# Altium schematic sheet VESC6.0.SchDoc
size A3
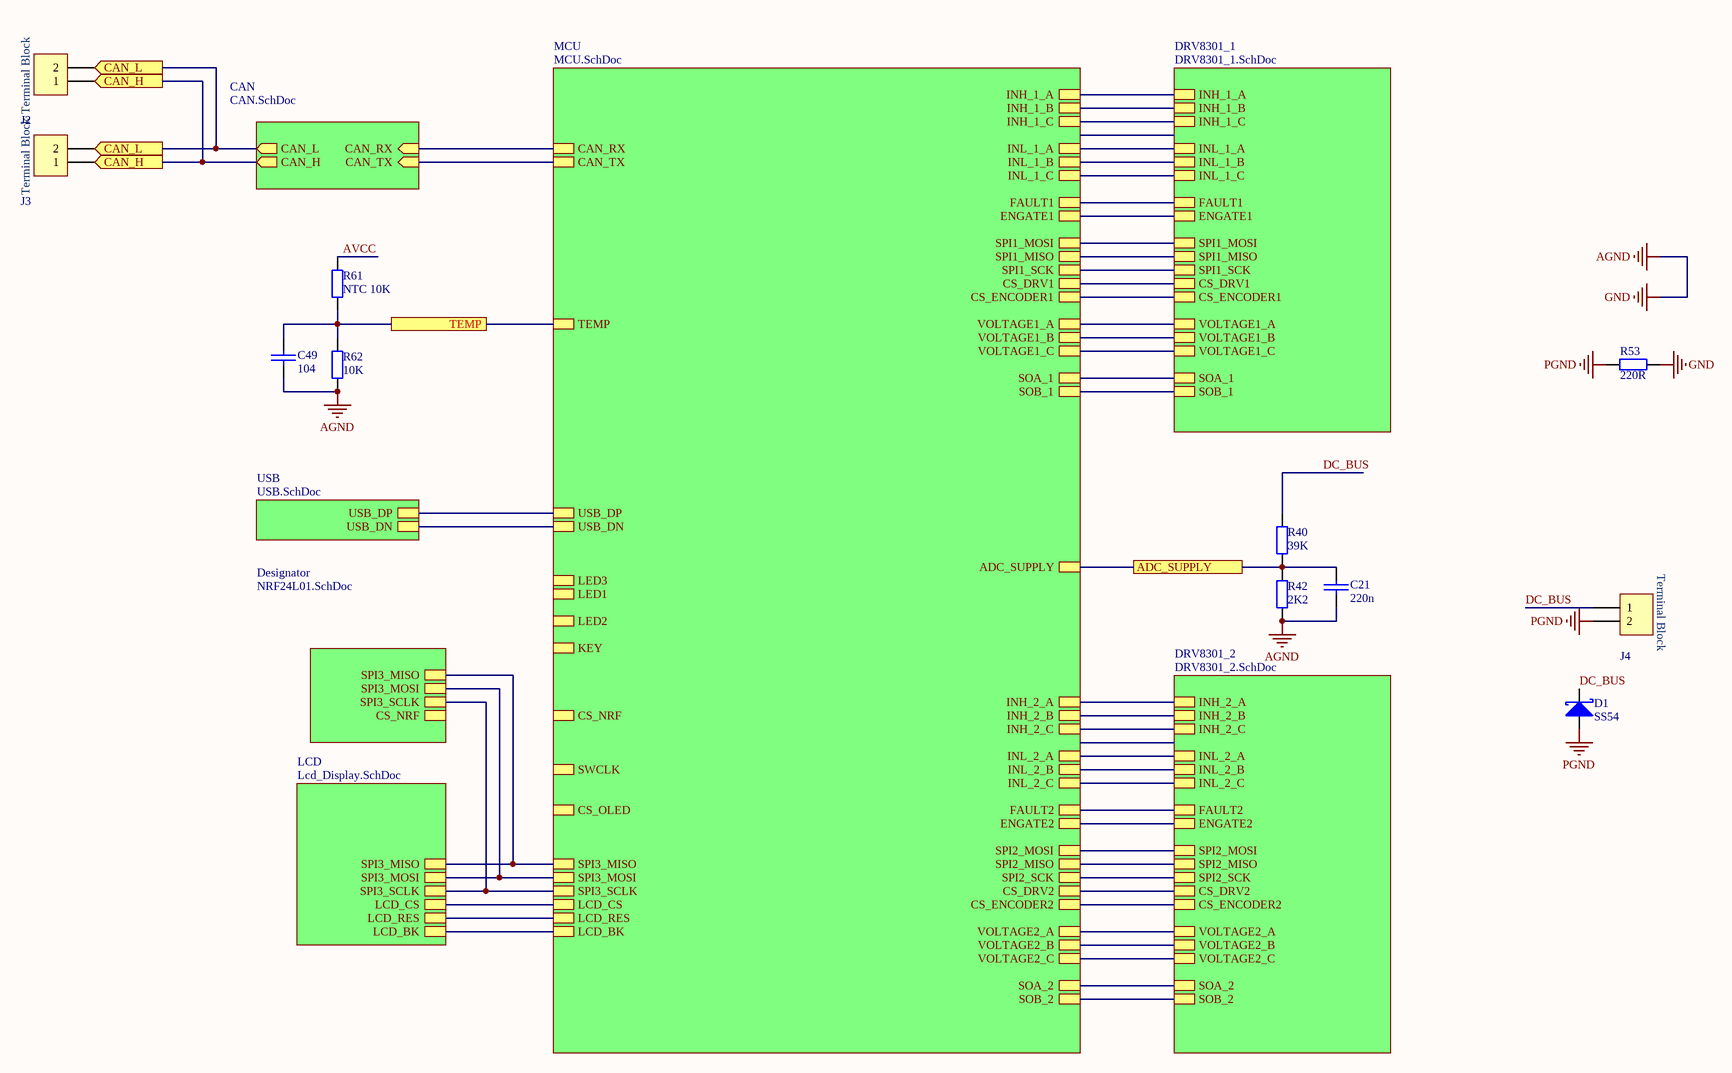
[diagram p0: VESC6.0.SchDoc]

## Parts
C21  value 220n  [0402C]  (hidden comment: CAP)
C49  value 104  [0402C]  (hidden comment: CAP)
D1  SS54  [DIODE_3*5.3]
J2  Terminal Block 2P  [A1002WR-S-2P]  (value not drawn)
J3  Terminal Block 2P  [A1002WR-S-2P]  (value not drawn)
J4  Terminal Block 2P  [POWER]  (value not drawn)
R40  39K  [0402R]
R42  2K2  [0402R]
R53  220R  [1206_R]
R61  NTC 10K  [0402R]
R62  10K  [0402R]

## Sub-sheets
CAN = CAN.SchDoc: CAN_H (out), CAN_RX (in), CAN_TX (in), CAN_L (out)
Designator = NRF24L01.SchDoc: SPI3_MISO, SPI3_SCLK, SPI3_MOSI, CS_NRF
DRV8301_1 = DRV8301_1.SchDoc: INL_1_B, INL_1_C, INH_1_B, INH_1_C, INH_1_A, INL_1_A, SPI1_MISO, SPI1_SCK, SPI1_MOSI, FAULT1, CS_DRV1, ENGATE1, VOLTAGE1_B, VOLTAGE1_A, VOLTAGE1_C, CS_ENCODER1, SOB_1, SOA_1
DRV8301_2 = DRV8301_2.SchDoc: INL_2_A, INH_2_C, INL_2_C, INH_2_B, INL_2_B, INH_2_A, SPI2_SCK, CS_DRV2, FAULT2, ENGATE2, SPI2_MOSI, SPI2_MISO, VOLTAGE2_C, VOLTAGE2_A, VOLTAGE2_B, CS_ENCODER2, SOB_2, SOA_2
LCD = Lcd_Display.SchDoc: SPI3_MISO, LCD_CS, SPI3_MOSI, LCD_RES, SPI3_SCLK, LCD_BK
MCU = MCU.SchDoc: INH_2_B, INH_2_A, INL_2_B, INL_2_A, INL_2_C, INH_2_C, INH_1_C, INH_1_A, INL_1_C, INH_1_B, INL_1_B, INL_1_A, VOLTAGE1_B, ADC_SUPPLY, USB_DP, VOLTAGE1_A, VOLTAGE2_B, VOLTAGE2_A, VOLTAGE1_C, USB_DN, CAN_RX, CAN_TX, VOLTAGE2_C, SPI3_MISO, CS_NRF, SPI3_MOSI, ENGATE2, CS_ENCODER1, SWCLK, SPI3_SCLK, FAULT2, CS_DRV2, CS_DRV1, CS_OLED, CS_ENCODER2, ENGATE1, FAULT1, LED1, SPI2_MISO, LED3, SPI1_MOSI, SPI2_SCK, KEY, LED2, SPI2_MOSI, SPI1_SCK, SPI1_MISO, LCD_CS, LCD_RES, LCD_BK, SOA_2, SOB_2, SOB_1, SOA_1, TEMP
USB = USB.SchDoc: USB_DP, USB_DN

## Ports
ADC_SUPPLY, CAN_H (out), CAN_L (out), TEMP

## Nets
AGND: C21.2 C49.2 R42.2 R53.2 R62.2  [also labelled GND]
PGND: D1.1(A) J4.2 R53.1
ADC_SUPPLY: C21.1 R40.1 R42.1 ; port ADC_SUPPLY, sheet MCU/ADC_SUPPLY
AVCC: R61.2
CAN_H: J2.1 J3.1 ; port CAN_H, sheet CAN/CAN_H
CAN_L: J2.2 J3.2 ; port CAN_L, sheet CAN/CAN_L
DC_BUS: D1.2(K) J4.1 R40.2
TEMP: C49.1 R61.1 R62.1 ; port TEMP, sheet MCU/TEMP
(unnamed): sheet DRV8301_1/INL_1_B, sheet MCU/INL_1_B
(unnamed): sheet DRV8301_1/INL_1_C, sheet MCU/INL_1_C
(unnamed): sheet DRV8301_1/INH_1_B, sheet MCU/INH_1_B
(unnamed): sheet DRV8301_1/INH_1_C, sheet MCU/INH_1_C
(unnamed): sheet DRV8301_1/INH_1_A, sheet MCU/INH_1_A
(unnamed): sheet DRV8301_1/INL_1_A, sheet MCU/INL_1_A
(unnamed): sheet DRV8301_1/SPI1_MISO, sheet MCU/SPI1_MISO
(unnamed): sheet DRV8301_1/SPI1_SCK, sheet MCU/SPI1_SCK
(unnamed): sheet DRV8301_1/SPI1_MOSI, sheet MCU/SPI1_MOSI
(unnamed): sheet DRV8301_1/FAULT1, sheet MCU/FAULT1
(unnamed): sheet DRV8301_1/CS_DRV1, sheet MCU/CS_DRV1
(unnamed): sheet DRV8301_1/ENGATE1, sheet MCU/ENGATE1
(unnamed): sheet DRV8301_1/VOLTAGE1_B, sheet MCU/VOLTAGE1_B
(unnamed): sheet DRV8301_1/VOLTAGE1_A, sheet MCU/VOLTAGE1_A
(unnamed): sheet DRV8301_1/VOLTAGE1_C, sheet MCU/VOLTAGE1_C
(unnamed): sheet DRV8301_1/CS_ENCODER1, sheet MCU/CS_ENCODER1
(unnamed): sheet DRV8301_1/SOB_1, sheet MCU/SOB_1
(unnamed): sheet DRV8301_1/SOA_1, sheet MCU/SOA_1
(unnamed): sheet MCU/INH_2_B, sheet DRV8301_2/INH_2_B
(unnamed): sheet MCU/INH_2_A, sheet DRV8301_2/INH_2_A
(unnamed): sheet MCU/INL_2_B, sheet DRV8301_2/INL_2_B
(unnamed): sheet MCU/INL_2_A, sheet DRV8301_2/INL_2_A
(unnamed): sheet MCU/INL_2_C, sheet DRV8301_2/INL_2_C
(unnamed): sheet MCU/INH_2_C, sheet DRV8301_2/INH_2_C
(unnamed): sheet MCU/USB_DP, sheet USB/USB_DP
(unnamed): sheet MCU/VOLTAGE2_B, sheet DRV8301_2/VOLTAGE2_B
(unnamed): sheet MCU/VOLTAGE2_A, sheet DRV8301_2/VOLTAGE2_A
(unnamed): sheet MCU/USB_DN, sheet USB/USB_DN
(unnamed): sheet MCU/CAN_RX, sheet CAN/CAN_RX
(unnamed): sheet MCU/CAN_TX, sheet CAN/CAN_TX
(unnamed): sheet MCU/VOLTAGE2_C, sheet DRV8301_2/VOLTAGE2_C
(unnamed): sheet MCU/SPI3_MISO, sheet LCD/SPI3_MISO, sheet Designator/SPI3_MISO
(unnamed): sheet MCU/SPI3_MOSI, sheet LCD/SPI3_MOSI, sheet Designator/SPI3_MOSI
(unnamed): sheet MCU/ENGATE2, sheet DRV8301_2/ENGATE2
(unnamed): sheet MCU/SPI3_SCLK, sheet LCD/SPI3_SCLK, sheet Designator/SPI3_SCLK
(unnamed): sheet MCU/FAULT2, sheet DRV8301_2/FAULT2
(unnamed): sheet MCU/CS_DRV2, sheet DRV8301_2/CS_DRV2
(unnamed): sheet MCU/CS_ENCODER2, sheet DRV8301_2/CS_ENCODER2
(unnamed): sheet MCU/SPI2_MISO, sheet DRV8301_2/SPI2_MISO
(unnamed): sheet MCU/SPI2_SCK, sheet DRV8301_2/SPI2_SCK
(unnamed): sheet MCU/SPI2_MOSI, sheet DRV8301_2/SPI2_MOSI
(unnamed): sheet MCU/LCD_CS, sheet LCD/LCD_CS
(unnamed): sheet MCU/LCD_RES, sheet LCD/LCD_RES
(unnamed): sheet MCU/LCD_BK, sheet LCD/LCD_BK
(unnamed): sheet MCU/SOA_2, sheet DRV8301_2/SOA_2
(unnamed): sheet MCU/SOB_2, sheet DRV8301_2/SOB_2

## Notes on the sheet
- (in symbol Terminal Block 2P) Terminal Block

## Library data of the parts
D1 = D Schottky: Schottky Diode; Published: 8-Jun-2000; LatestRevisionDate: 17-Jul-2002; LatestRevisionNote: Re-released for DXP Platform.; PackageReference: SMB; Publisher: Altium Limited; PackageDescription: DO-214-AA/SMB; 2 C-Bend Leads; Body 5.3 x 3.6 mm, inc. leads (LxW); Code_JEDEC: DO-214-AA
R40 R42 R53 = Res2: Resistor; Value: 10K; Published: 8-Jun-2000; LatestRevisionDate: 17-Jul-2002; LatestRevisionNote: Re-released for DXP Platform.; PackageReference: AXIAL-0.4; Publisher: Altium Limited; PackageDescription: Axial Device, Thru-Hole; 2 Leads; 0.4 in Pin Spacing
R61 R62 = Res2: Resistor; Published: 8-Jun-2000; LatestRevisionDate: 17-Jul-2002; LatestRevisionNote: Re-released for DXP Platform.; PackageReference: AXIAL-0.4; Publisher: Altium Limited; PackageDescription: Axial Device, Thru-Hole; 2 Leads; 0.4 in Pin Spacing; Value: 10K